# EAGLE design ESP1 (EAGLE 6.6.0)
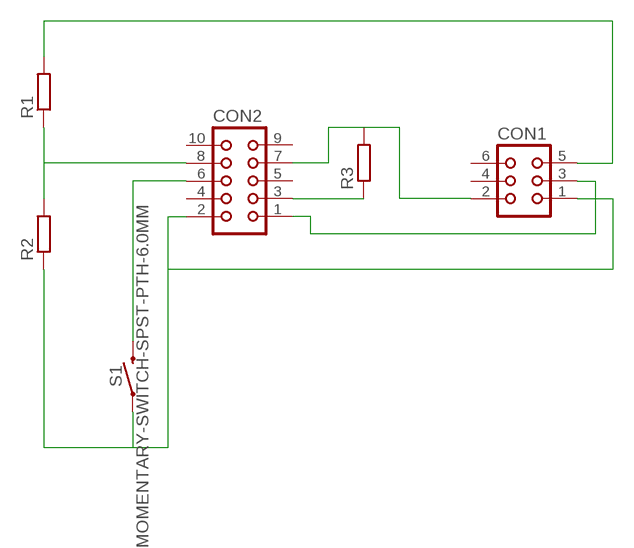
[diagram p0: schematic, sheet 1]

## Parts
CON1  CON06L  [CON06L]
CON2  CON10L  [CON10L]
R1  R-EU_0204/7  [0204/7]
R2  R-EU_0204/7  [0204/7]
R3  R-EU_0204/7  [0204/7]
S1  MOMENTARY-SWITCH-SPST-PTH-6.0MM  [TACTILE_SWITCH_PTH_6.0MM]

## Nets
N$1: CON1.1 CON2.2 R2.1 S1.1
N$2: CON2.8 R1.1 R2.2
N$3: CON1.5 R1.2
N$4: CON1.3 CON2.1
N$5: CON2.3 R3.1
N$6: CON1.2 CON2.7 R3.2
N$7: CON2.6 S1.3
Unconnected: CON1.4 CON1.6 CON2.4 CON2.5 CON2.9 CON2.10

## Library data of the parts
CON1 = con-harting:CON06L: CONNECTOR; OC_FARNELL: unknown; OC_NEWARK: unknown
CON2 = con-harting:CON10L: CONNECTOR; OC_FARNELL: unknown; OC_NEWARK: unknown
R1-R3 = resistor:R-EU_: RESISTOR, European symbol
S1 = SparkFun-Switches:MOMENTARY-SWITCH-SPST: Momentary Switch (Pushbutton) - SPST Normally-open (NO) SPST momentary switches (buttons, pushbuttons). Variants PTH-12MM - 12mm square, through-hole Momentary Pushbutton Switch - 12mm Square <https://www.sparkfun.com/products/9190> (COM-09190) PTH-6.0MM, PTH-6.0MM-KIT - 6.0mm square, through-hole Mini Pushbutton Switch <https://www.sparkfun.com/products/97> (COM-00097) KIT package intended for soldering kit's - only one side of pads' copper is exposed. PTH-RIGHT-ANGLE-KIT - Right-angle, through-hole Right Angle Tactile Button <https://www.sparkfun.com/products/10791> - Used on SparkFun BigTime Watch Kit <https://www.sparkfun.com/products/11734> SMD-12MM - 12mm square, surface-mount Tactile Button - SMD (12mm) <https://www.sparkfun.com/products/12993> (COM-12993) Used on SparkFun PicoBoard <https://www.sparkfun.com/products/11888> SMD-4.5MM - 4.5mm Square Trackball Switch Used on SparkFun Blackberry Trackballer Breakout <https://www.sparkfun.com/products/13169> SMD-4.6MMX2.8MM - 4.60mm x 2.80mm, surface mount Used on SparkFun Pro Micro - RP2040 <https://www.sparkfun.com/products/17717> SMD-5.2MM, SMD-5.2-REDUNDANT - 5.2mm square, surface-mount Mini Pushbutton Switch - SMD <https://www.sparkfun.com/products/8720> (COM-08720) Used on Arduino Pro Mini <https://www.sparkfun.com/products/11114> REDUNDANT package connects both switch circuits together SMD-6.0X3.5MM - 6.0 x 3.5mm, surface mount Momentary Reset Switch SMD <https://www.sparkfun.com/products/8229> (COM-08229) SMD-6.2MM-TALL - 6.2mm square, surface mount Tactile Button - SMD (6mm) <https://www.sparkfun.com/products/12992> Used on SparkFun Digital Sandbox <https://www.sparkfun.com/products/12651> SMD-RIGHT-ANGLE - Right-angle, surface mount Used on SparkFun Block for Intel® Edison - Arduino <https://www.sparkfun.com/products/13036>; PROD_ID: SWCH-08441; SF_SKU: COM-00097

## Board
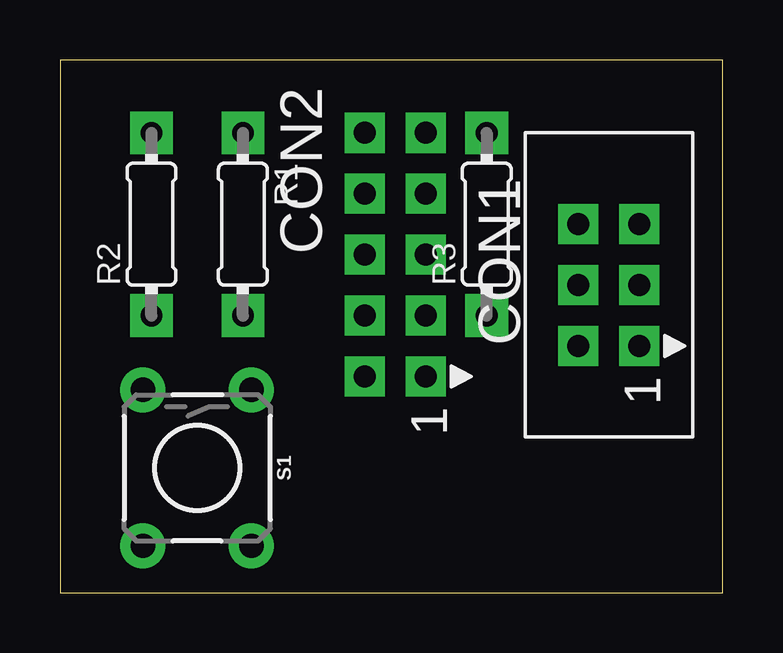
[diagram p1: board, top side]
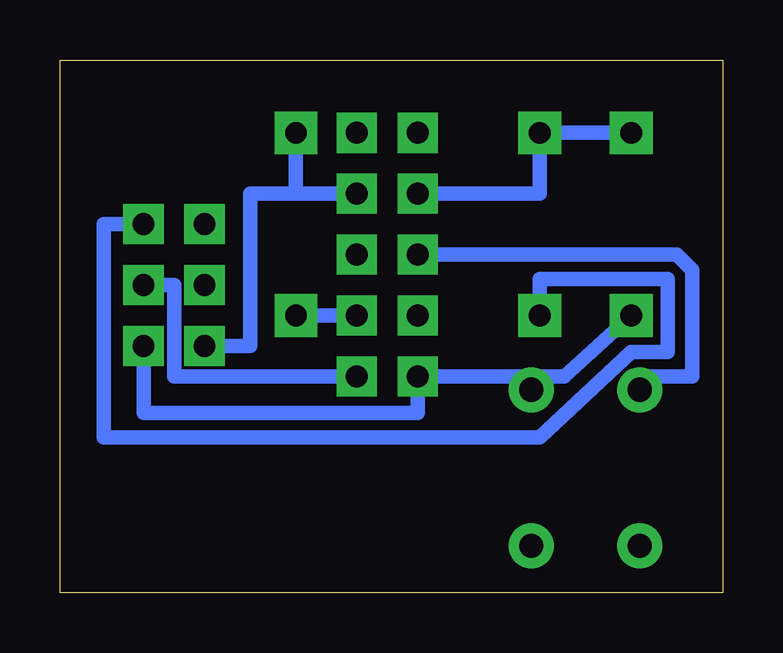
[diagram p2: board, bottom side, seen from below]

Size 27.61 x 22.21 mm. Coordinates in mm from the lower left corner, seen from the top.
Outline: 0,0 27.61,0 27.61,22.21 0,22.21 0,0
Copper layers (1*16): Top 0.035mm / dielectric 1.5mm / Bottom 0.035mm
Design rules "default": minimum track width 10mil, minimum drill 24mil, track to track 8mil, track to pad 8mil, pad to pad 8mil, via to via 8mil, smd to smd 8mil, copper to edge 40mil, drill to drill 8mil, minimum pad ring 10mil, minimum via ring 8mil, stop-mask expansion 4mil, vias tented up to drill 0mil, thermal gap 10mil

### Footprints (pad centres in the part's own frame; a part is rotated, then mirrored left to right if it is on the bottom)
CON06L = drill 0.914 pad 1.676 square: 1 2.54,1.27; 2 2.54,-1.27; 3 0,1.27; 4 0,-1.27; 5 -2.54,1.27; 6 -2.54,-1.27
CON10L = drill 0.914 pad 1.676 square: 1 5.08,1.27; 2 5.08,-1.27; 3 2.54,1.27; 4 2.54,-1.27; 5 0,1.27; 6 0,-1.27; 7 -2.54,1.27; 8 -2.54,-1.27; 9 -5.08,1.27; 10 -5.08,-1.27
0204/7 = drill 0.9 pad 1.778 square: 1 -3.81,0; 2 3.81,0
TACTILE_SWITCH_PTH_6.0MM = drill 1.016 pad 1.88: 1 -3.251,2.261; 2 3.251,2.261; 3 -3.251,-2.261; 4 3.251,-2.261

### Placement (x,y rotation side)
CON1  22.86,12.83 270 top
CON2  13.97,14.1 270 top
R1  7.62,15.37 270 top
R2  3.81,15.37 90 top
R3  17.78,15.37 90 top
S1  5.71,5.21 270 top

### Tracks (layer width: path | path; a pad name or v marks a point on that pad's centre or on a via)
N$1
  Bottom 0.61: CON1.1 24.13,7.49 12.7,7.49 CON2.2 8,9.02 | R2.1 6.6,9.02 8,9.02 | 8,9.02 S1.1
N$2
  Bottom 0.61: CON2.8 7.62,16.64 R1.1 R2.2
N$3
  Bottom 0.61: CON1.5 25.78,15.37 25.78,6.48 7.62,6.48 3.81,10.03 2.29,10.03 2.29,13.08 7.62,13.08 R1.2
N$4
  Bottom 0.61: CON2.1 22.86,9.02 22.86,12.83 CON1.3
N$5
  Bottom 0.61: R3.1 CON2.3
N$6
  Bottom 0.61: CON1.2 19.68,10.29 19.68,16.64 17.78,16.64 | 17.78,16.64 CON2.7 | R3.2 17.78,16.64
N$7
  Bottom 0.61: CON2.6 1.91,14.1 1.27,13.46 1.27,9.02 3.81,9.02 S1.3